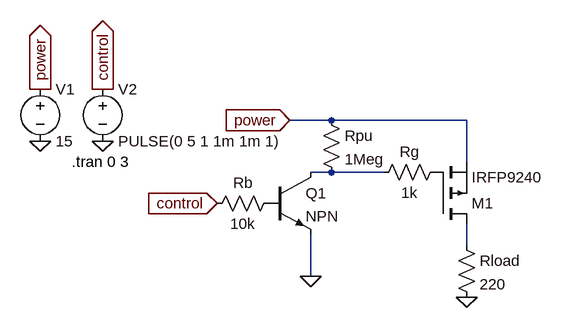
[diagram p0: schematic switch-npn-pmos15.asc]
switch-npn-pmos15.asc, the LTspice schematic file:
Version 4
SHEET 1 880 680
WIRE 32 80 -32 80
WIRE 240 80 32 80
WIRE 240 144 240 80
WIRE 32 160 0 160
WIRE 112 160 32 160
WIRE 240 272 240 240
WIRE 0 320 0 256
FLAG 240 352 0
FLAG -144 208 control
IOPIN -144 208 In
FLAG -32 80 power
IOPIN -32 80 In
FLAG -416 112 0
FLAG -416 32 power
IOPIN -416 32 Out
FLAG -320 112 0
FLAG -320 32 control
IOPIN -320 32 Out
FLAG 0 320 0
SYMBOL Res 224 256 R0
SYMATTR InstName Rload
SYMATTR Value 220
SYMBOL Res 208 144 R90
WINDOW 0 0 56 VBottom 2
WINDOW 3 32 56 VTop 2
SYMATTR InstName Rg
SYMATTR Value 1k
SYMBOL Voltage -416 16 R0
SYMATTR InstName V1
SYMATTR Value 15
SYMBOL Voltage -320 16 R0
SYMATTR InstName V2
SYMATTR Value PULSE(0 5 1 1m 1m 1)
SYMBOL Res 16 64 R0
SYMATTR InstName Rpu
SYMATTR Value 1Meg
SYMBOL pmos 192 240 M180
SYMATTR InstName M1
SYMATTR Value IRFP9240
SYMBOL npn -64 160 R0
SYMATTR InstName Q1
SYMBOL Res -48 192 R90
WINDOW 0 0 56 VBottom 2
WINDOW 3 32 56 VTop 2
SYMATTR InstName Rb
SYMATTR Value 10k
TEXT -368 144 Left 2 !.tran 0 3

The netlist it stands for:
* switch-npn-pmos15.asc
Rload N002 0 220
Rg P001 N001 1k
V1 power 0 15
V2 control 0 PULSE(0 5 1 1m 1m 1)
Rpu power N001 1Meg
M1 N002 P001 power power IRFP9240
Q1 N001 P002 0 0 NPN
Rb P002 control 10k
.model NPN NPN
.model PNP PNP
.lib standard.bjt
.model NMOS NMOS
.model PMOS PMOS
.lib standard.mos
.tran 0 3
.backanno
.end